# Altium project Amb_Enviro_MCU_PCB.PrjPcb
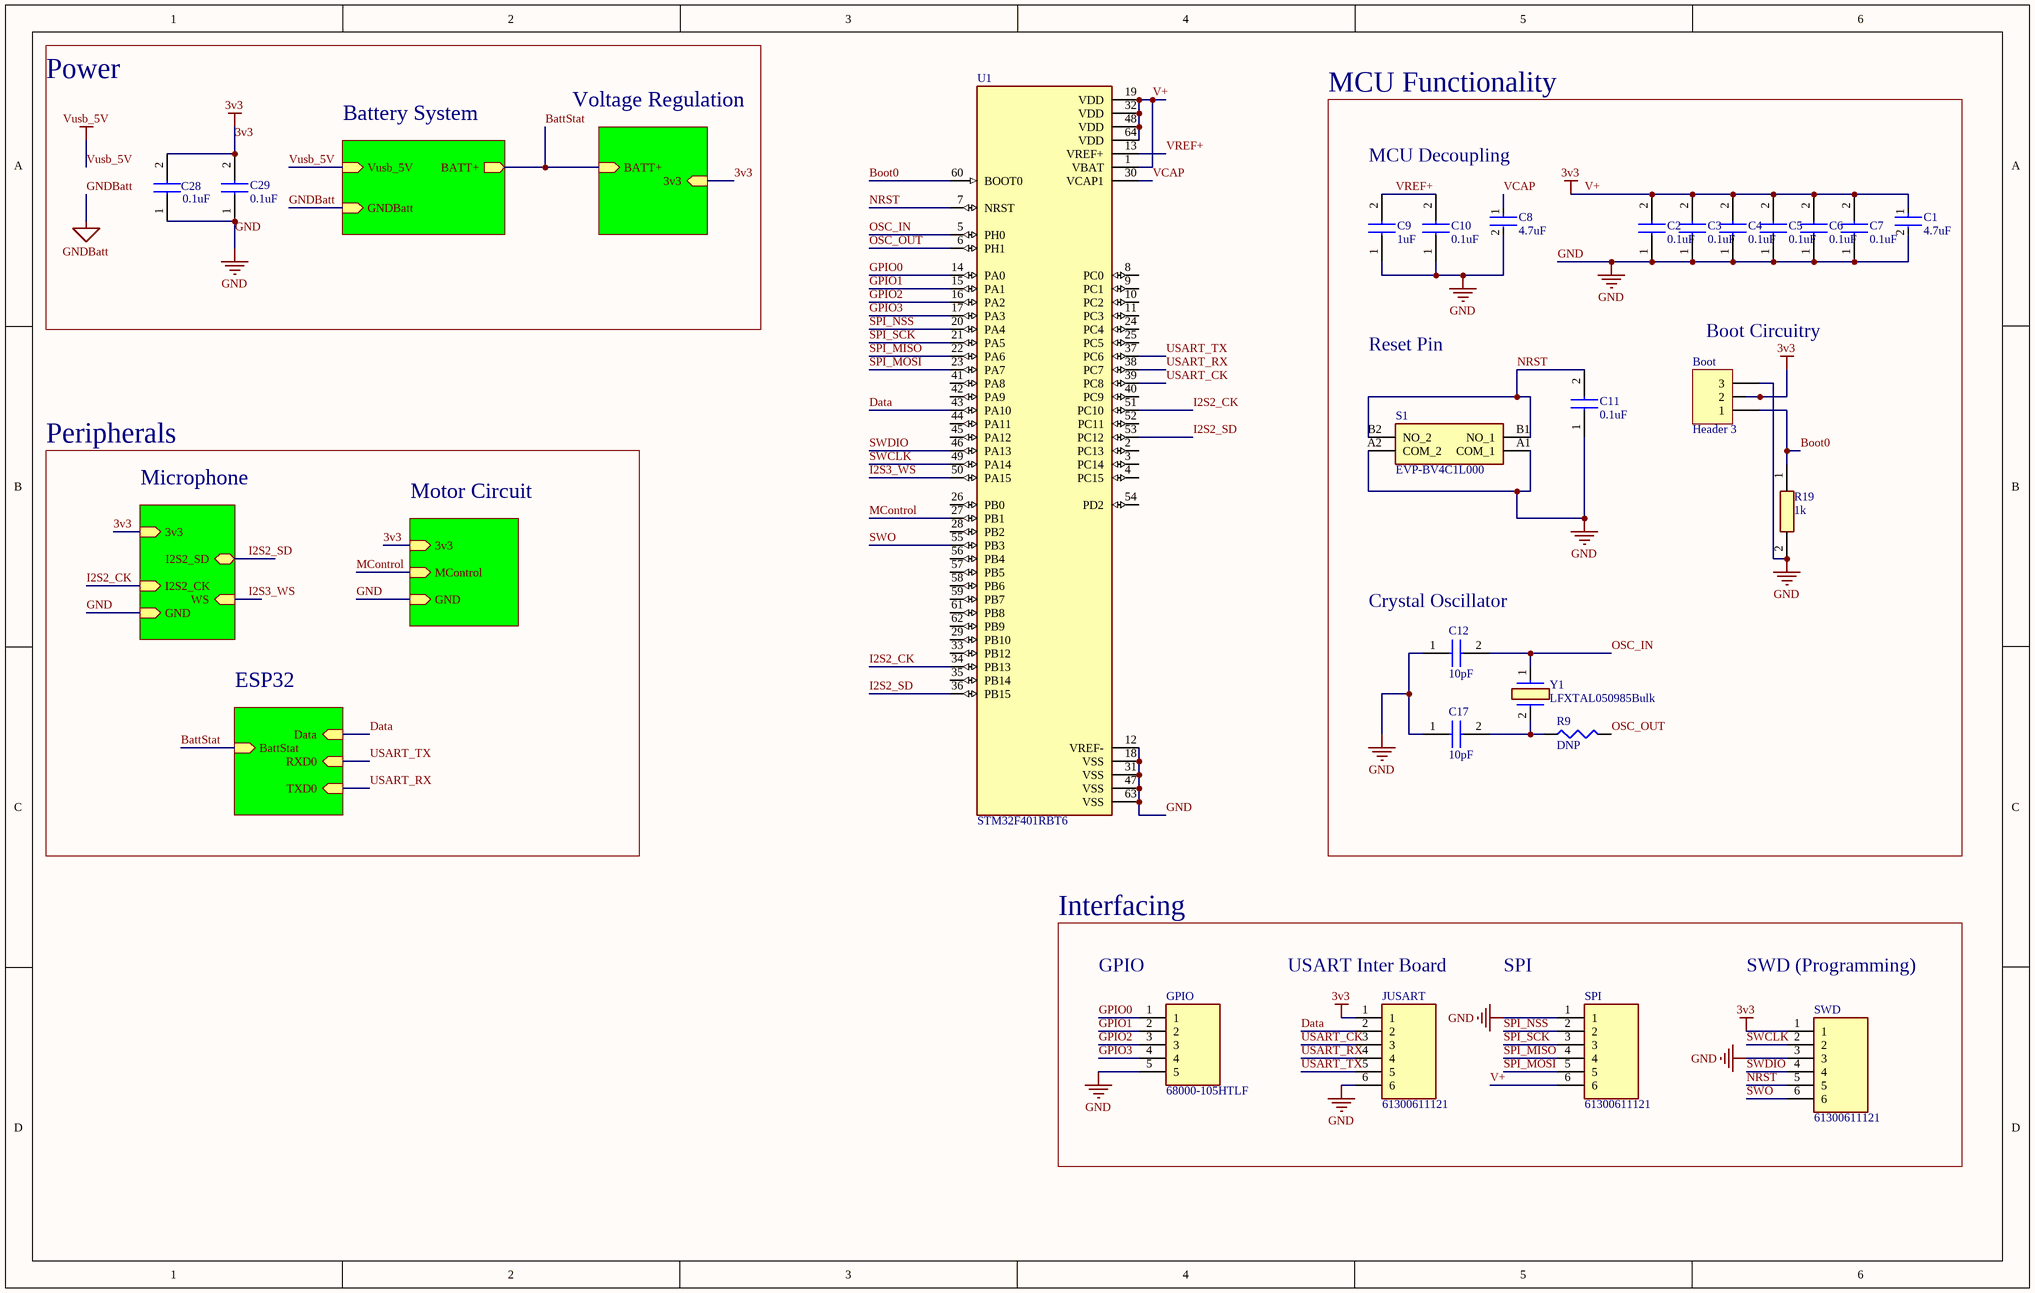
[diagram p0: MCU_Transceiver_Board.SchDoc]
6 sheets, 80 parts. Net scope: hierarchical (ports join the sheet entries above them; power ports are global).
Board file: MCU_Transceiver_Board.PcbDoc
Sheets:
  MCU_Transceiver_Board.SchDoc
    Microphone = Microphone.SchDoc
    Voltage Regulation = Voltage Regulation.SchDoc
    Battery System = Battery System.SchDoc
    Motor Circuit = Motor Circuit.SchDoc
    ESP32 = ESP32.SchDoc

## Sheet MCU_Transceiver_Board.SchDoc
size B; SheetNumber: 1; SheetTotal: 6

### Parts
Boot  Header 3  [HDR1X3]
C1  4.7uF  [FP-1206-L_3_2_0_2-W_1_6_0-IPC_B]
C2  0.1uF  [CAPC3216X180N]
C3  0.1uF  [CAPC3216X180N]
C4  0.1uF  [CAPC3216X180N]
C5  0.1uF  [CAPC3216X180N]
C6  0.1uF  [CAPC3216X180N]
C7  0.1uF  [CAPC3216X180N]
C8  4.7uF  [FP-1206-L_3_2_0_2-W_1_6_0-IPC_B]
C9  1uF  [CAPC1608X90N]
C10  0.1uF  [CAPC3216X180N]
C11  0.1uF  [CAPC3216X180N]
C12  10pF  [CAPC1608X90N]
C17  10pF  [CAPC1608X90N]
C28  0.1uF  [CAPC3216X180N]
C29  0.1uF  [CAPC3216X180N]
GPIO  68000-105HTLF  [HDRV5W67P0X254_1X5_1270X241X858P]
JUSART  61300611121  [HDRV6W64P0X254_1X6_1524X254X869P]
R9  value DNP  [J1-0603]  (hidden comment: Res3)
R19  1k  [RESC3016X65N]
S1  EVP-BV4C1L000  [EVPBV4C1L000]
SPI  61300611121  [HDRV6W64P0X254_1X6_1524X254X869P]
SWD  61300611121  [HDRV6W64P0X254_1X6_1524X254X869P]
U1  STM32F401RBT6  [QFP50P1200X1200X160-64N]
Y1  LFXTAL050985Bulk  [LFXTAL050985Bulk]

### Blocks framed on the sheet
Power: C28 C29
MCU Functionality: Boot C1-C12 C17 R9 R19 S1 Y1
Interfacing: GPIO JUSART SPI SWD

### Sub-sheets
Battery System = Battery System: Vusb_5V (in), GNDBatt (in), BATT+ (out)
ESP32 = ESP32: Data (in), RXD0 (in), TXD0 (in), BattStat (in)
Microphone = Microphone: 3v3 (in), I2S2_SD (bidir), I2S2_CK (in), GND (in), WS (in)
Motor Circuit = Motor Circuit: 3v3 (in), GND (in), MControl (in)
Voltage Regulation = Voltage Regulation: BATT+ (in), 3v3 (in)

### Nets
3v3: Boot.2 C1.1 C2.2 C3.2 C4.2 C5.2 C6.2 C7.2 C28.2 C29.2 JUSART.1 SPI.6 SWD.1 U1.1(VBAT) U1.19(VDD) U1.32(VDD) U1.48(VDD) U1.64(VDD) ; sheet Microphone/3v3, sheet Voltage Regulation/3v3, sheet Motor Circuit/3v3  [also labelled V+]
GND: Boot.3 C1.2 C2.1 C3.1 C4.1 C5.1 C6.1 C7.1 C8.2 C9.1 C10.1 C11.1 C12.1 C17.1 C28.1 C29.1 GPIO.5 JUSART.6 R19.2 S1.A1(COM_1) S1.A2(COM_2) SPI.1 SWD.3 U1.12(VREF-) U1.18(VSS) U1.31(VSS) U1.47(VSS) U1.63(VSS) ; sheet Microphone/GND, sheet Motor Circuit/GND
BattStat: sheet Voltage Regulation/BATT+, sheet Battery System/BATT+, sheet ESP32/BattStat
Boot0: Boot.1 R19.1 U1.60(BOOT0)
Data: JUSART.2 U1.43(PA10) ; sheet ESP32/Data
GPIO0: GPIO.1 U1.14(PA0)
GPIO1: GPIO.2 U1.15(PA1)
GPIO2: GPIO.3 U1.16(PA2)
GPIO3: GPIO.4 U1.17(PA3)
I2S2_CK: U1.34(PB13) U1.51(PC10) ; sheet Microphone/I2S2_CK
I2S2_SD: U1.36(PB15) U1.53(PC12) ; sheet Microphone/I2S2_SD
I2S3_WS: U1.50(PA15) ; sheet Microphone/WS
MControl: U1.27(PB1) ; sheet Motor Circuit/MControl
NRST: C11.2 S1.B1(NO_1) S1.B2(NO_2) SWD.5 U1.7(NRST)
OSC_IN: C12.2 U1.5(PH0) Y1.1
OSC_OUT: R9.2 U1.6(PH1)
SPI_MISO: SPI.4 U1.22(PA6)
SPI_MOSI: SPI.5 U1.23(PA7)
SPI_NSS: SPI.2 U1.20(PA4)
SPI_SCK: SPI.3 U1.21(PA5)
SWCLK: SWD.2 U1.49(PA14)
SWDIO: SWD.4 U1.46(PA13)
SWO: SWD.6 U1.55(PB3)
USART_CK: JUSART.3 U1.39(PC8)
USART_RX: JUSART.4 U1.38(PC7) ; sheet ESP32/TXD0  [project net TXD0]
USART_TX: JUSART.5 U1.37(PC6) ; sheet ESP32/RXD0  [project net RXD0]
VCAP: C8.1 U1.30(VCAP1)
VREF+: C9.2 C10.2 U1.13(VREF+)
NetC17_2: C17.2 R9.1 Y1.2

Not connected (* = marked no-connect by the designer): U1 2(PC13) 3(PC14) 4(PC15) 8(PC0) 9(PC1) 10(PC2) 11(PC3) 24(PC4) 25(PC5) 26(PB0) 28(PB2) 29(PB10) 33(PB12) 35(PB14) 40(PC9) 41(PA8) 42(PA9) 44(PA11) 45(PA12) 52(PC11) 54(PD2) 56(PB4) 57(PB5) 58(PB6) 59(PB7) 61(PB8) 62(PB9)

### Notes on the sheet
- MCU Decoupling
- Reset Pin
- (near Boot) Boot Circuitry
- Peripherals
- (near C12) Crystal Oscillator
- (near GPIO) GPIO
- (near JUSART) USART Inter Board
- SPI
- SWD (Programming)

### Library data of the parts
Boot = Header 3: Header, 3-Pin; LatestRevisionDate: 17-Jul-2002; LatestRevisionNote: Re-released for DXP Platform.; Publisher: Altium Limited
C1 C8 = CMP-04427-012562-1: General Purpose Ceramic Capacitor, 1206, 4.7uF, 20%, X5R, 15%, 16V, 1206YD475MAT2A; Dissipation Factor: 5%; Tolerance: 20%; Length: 3.2mm; Min Operating Temperature: -55°C; Width: 0.063inch; Capacitance: 4.7uF; Dielectric: X5R; Case Code (Imperial): 1206; Termination: SMD/SMT; Package Quantity: 1; Depth: 1.6mm; Height: 0.07mm; Voltage Rating: 16V; Mount: Surface Mount; Lead Free: Lead Free; Construction: Flat; Case/Package: 1206; Max Operating Temperature: 85°C; Contact Plating: Tin; Voltage Rating (DC): 16V; Series: -; Case Code (Metric): 3216; RoHS Compliant: Yes; Thickness: 0.07inch; Packaging: Tape and Reel; Number of Pins: 2; Radiation Hardening: No
C2 C10 C11 C28 C29 = GCM31C5C1H104FA16L: Capacitor, GCM31C5C1H104FA16L, 1206; Manufacturer_Name: Murata Electronics; Datasheet Link: https://www.digikey.in/product-detail/en/murata-electronics/GCM31C5C1H104FA16L/490-GCM31C5C1H104FA16LCT-ND/11618925; Height: 1.8mm; Manufacturer_Part_Number: GCM31C5C1H104FA16L; Mouser Part Number: 81-GCM31C5C1H104FA16; Mouser Price/Stock: https://www.mouser.co.uk/ProductDetail/Murata-Electronics/GCM31C5C1H104FA16L?qs=rrS6PyfT74fke0d0BEF0PA%3D%3D; Arrow Part Number: GCM31C5C1H104FA16L; Arrow Price/Stock: https://www.arrow.com/en/products/gcm31c5c1h104fa16l/murata-manufacturing
C3-C7 = GCM31C5C1H104FA16L: Capacitor, C5C1H104FA16L; Manufacturer_Name: Murata Electronics; Datasheet Link: https://www.digikey.in/product-detail/en/murata-electronics/GCM31C5C1H104FA16L/490-GCM31C5C1H104FA16LCT-ND/11618925; Height: 1.8mm; Manufacturer_Part_Number: GCM31C5C1H104FA16L; Mouser Part Number: 81-GCM31C5C1H104FA16; Mouser Price/Stock: https://www.mouser.co.uk/ProductDetail/Murata-Electronics/GCM31C5C1H104FA16L?qs=rrS6PyfT74fke0d0BEF0PA%3D%3D; Arrow Part Number: GCM31C5C1H104FA16L; Arrow Price/Stock: https://www.arrow.com/en/products/gcm31c5c1h104fa16l/murata-manufacturing
C9 = 0603YC105JAT2A: Capacitor, 0603YC10JAT2A; Manufacturer_Name: AVX; Datasheet Link: http://www.mouser.com/catalog/supplier/library/pdf/AVXSurfaceMountCeramic.pdf; Height: 0.9mm; Manufacturer_Part_Number: 0603YC105JAT2A; Mouser Part Number: 581-0603YC105JAT2A; Mouser Price/Stock: https://www.mouser.co.uk/ProductDetail/AVX/0603YC105JAT2A/?qs=RCLU9o6%252BptxSjO%252BNXwzoBQ%3D%3D; Arrow Part Number: 0603YC105JAT2A; Arrow Price/Stock: https://www.arrow.com/en/products/0603yc105jat2a/avx
C12 C17 = 06035A100F4T4A: Capacitor, 10pF, 06035A100F4T4A; Manufacturer_Name: AVX; Datasheet Link: https://componentsearchengine.com/Datasheets/1/06031A100FAT2A.pdf; Height: 0.9mm; Manufacturer_Part_Number: 06035A100F4T4A; Mouser Part Number: 581-06035A100F4T4A; Mouser Price/Stock: https://www.mouser.co.uk/ProductDetail/AVX/06035A100F4T4A?qs=T3oQrply3y8l7Nbuh1mZXA%3D%3D
GPIO = 68000-105HTLF: Connector; Manufacturer_Name: Amphenol; Datasheet Link: https://www.arrow.com/en/products/68000-105htlf/amphenol-fci; Height: 8.58mm; Manufacturer_Part_Number: 68000-105HTLF; Mouser Part Number: 649-68000-105HTLF; Mouser Price/Stock: https://www.mouser.co.uk/ProductDetail/Amphenol-FCI/68000-105HTLF?qs=w%2Fv1CP2dgqrYgNyQVoiqDw%3D%3D; Arrow Part Number: 68000-105HTLF; Arrow Price/Stock: https://www.arrow.com/en/products/68000-105htlf/amphenol-fci
JUSART SPI SWD = 61300611121: Connector; Manufacturer_Name: Wurth Elektronik; Datasheet Link: https://componentsearchengine.com/Datasheets/2/61300611121.pdf; Height: 8.69mm; Manufacturer_Part_Number: 61300611121; Mouser Part Number: 710-61300611121; Mouser Price/Stock: https://www.mouser.co.uk/ProductDetail/Wurth-Elektronik/61300611121?qs=t4813l51qx%2FRpdf0Kp1HlQ%3D%3D
R9 = Res3: Resistor; Published: 8-Jun-2000; LatestRevisionDate: 29-May-2009; LatestRevisionNote: IPC-7351 Footprint Added.; PackageReference: J1-0603; Publisher: Altium Limited; PackageDescription: Chip Resistor
R19 = CRT1206-FZ-1001ELF: Resistor, CRT1206-FZ-1001ELF; Manufacturer_Name: Bourns; Datasheet Link: http://www.bourns.com/docs/Product-Datasheets/crt-as.pdf; Height: 0.65mm; Manufacturer_Part_Number: CRT1206-FZ-1001ELF; Mouser Part Number: 652-CRT1206FZ1001ELF; Mouser Price/Stock: https://www.mouser.co.uk/ProductDetail/Bourns/CRT1206-FZ-1001ELF?qs=Zq5ylnUbLm4KSc2M9tALXQ%3D%3D; Arrow Part Number: CRT1206-FZ-1001ELF; Arrow Price/Stock: https://www.arrow.com/en/products/crt1206-fz-1001elf/bourns?region=nac
S1 = EVP-BV4C1L000: Switch; Manufacturer_Name: Panasonic; Datasheet Link: https://www.mouser.de/datasheet/2/315/Panasonic_Switch__EVP_BV_Series__030122-2933967.pdf; Height: 3.7mm; Manufacturer_Part_Number: EVP-BV4C1L000; Mouser Part Number: 667-EVP-BV4C1L000; Mouser Price/Stock: https://www.mouser.co.uk/ProductDetail/Panasonic/EVP-BV4C1L000?qs=MyNHzdoqoQKwTvV8HYjCOw%3D%3D
U1 = STM32F401RBT6: ARMÂ® CortexÂ®-M4 STM32F4 Microcontroller IC 32-Bit 84MHz 128KB _128K x 8_ FLASH 64-LQFP _10x10_; MF: STMicroelectronics; Availability: Unavailable; MP: STM32F401RBT6; Price: None; Value: *; SnapEDA_Link: https://www.snapeda.com/parts/STM32F401RBT6/STMicroelectronics/view-part/49021/?ref=snap; Package: LQFP-64 STMicroelectronics
Y1 = LFXTAL050985Bulk: Crystal or Oscillator; Manufacturer_Name: IQD; Datasheet Link: https://componentsearchengine.com/Datasheets/1/LFXTAL050985Bulk.pdf; Height: 4.3mm; Manufacturer_Part_Number: LFXTAL050985Bulk; Mouser Part Number: 449-LFXTAL050985BULK; Mouser Price/Stock: https://www.mouser.com/Search/Refine.aspx?Keyword=449-LFXTAL050985BULK

## Sheet Microphone.SchDoc
size A4; SheetNumber: 3; SheetTotal: 6
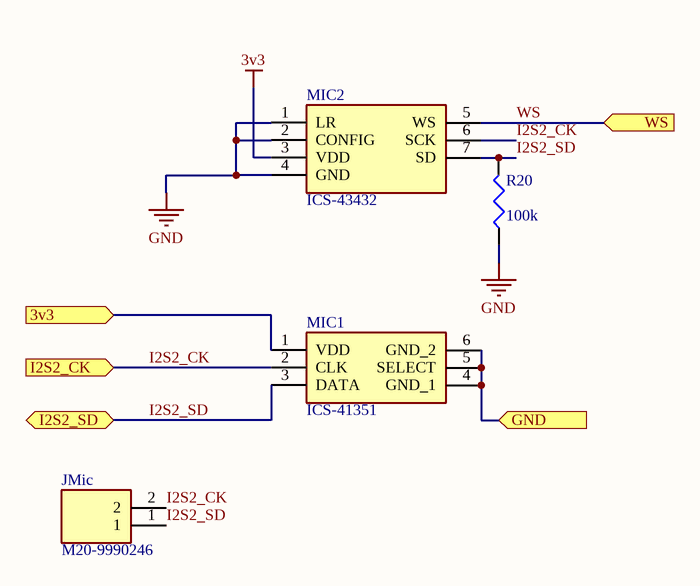
[diagram p1: Microphone.SchDoc]

### Parts
JMic  M20-9990246  [HDRV2W66P0X254_1X2_508X254X874P]
MIC1  ICS-41351  [ICS41351]
MIC2  ICS-43432  [ICS43432]
R20  value 100k  [J1-0603]  (hidden comment: Res3)

### Ports
3v3 (in), GND (in), I2S2_CK (in), I2S2_SD (bidir), WS (in)

### Nets
3v3: MIC1.1(VDD) MIC2.3(VDD) ; port 3v3
GND: MIC1.4(GND_1) MIC1.5(SELECT) MIC1.6(GND_2) MIC2.1(LR) MIC2.2(CONFIG) MIC2.4(GND) R20.1 ; port GND
I2S2_CK: JMic.2 MIC1.2(CLK) MIC2.6(SCK) ; port I2S2_CK
I2S2_SD: JMic.1 MIC1.3(DATA) MIC2.7(SD) R20.2 ; port I2S2_SD
WS: MIC2.5(WS) ; port WS  [project net I2S3_WS]

### Library data of the parts
JMic = M20-9990246: Connector; Manufacturer_Name: Harwin; Datasheet Link: https://cdn.harwin.com/pdfs/M20-999.pdf; Height: 8.74mm; Manufacturer_Part_Number: M20-9990246; Mouser Part Number: 855-M20-9990246; Mouser Price/Stock: https://www.mouser.co.uk/ProductDetail/Harwin/M20-9990246?qs=Jph8NoUxIfWjw4WmyRvzag%3D%3D
MIC1 = ICS-41351: Microphone; Manufacturer_Name: TDK; Datasheet Link: https://product.tdk.com/system/files/dam/doc/product/sw_piezo/mic/mems-mic/data_sheet/ds-000157-ics-41351-v1.1.pdf; Height: 1.08mm; Manufacturer_Part_Number: ICS-41351; Mouser Part Number: 410-ICS-41351; Mouser Price/Stock: https://www.mouser.co.uk/ProductDetail/TDK-InvenSense/ICS-41351?qs=%252B6g0mu59x7LDJ1mBnROZzA%3D%3D; Arrow Part Number: ICS-41351; Arrow Price/Stock: https://www.arrow.com/en/products/ics-41351/invensense
MIC2 = ICS-43432: Integrated Circuit; Manufacturer_Name: TDK; Datasheet Link: https://product.tdk.com/system/files/dam/doc/product/sw_piezo/mic/mems-mic/data_sheet/ics-43432-data-sheet-v1.3.pdf; Height: 1.1mm; Manufacturer_Part_Number: ICS-43432; Mouser Part Number: 410-ICS-43432; Mouser Price/Stock: https://www.mouser.co.uk/ProductDetail/TDK-InvenSense/ICS-43432?qs=u4fy%2FsgLU9PhEy4uYlgedw%3D%3D; Arrow Part Number: ICS-43432; Arrow Price/Stock: https://www.arrow.com/en/products/ics-43432/invensense?region=nac
R20 = Res3: Resistor; Published: 8-Jun-2000; LatestRevisionDate: 29-May-2009; LatestRevisionNote: IPC-7351 Footprint Added.; PackageReference: J1-0603; Publisher: Altium Limited; PackageDescription: Chip Resistor

## Sheet Voltage Regulation.SchDoc
size A4; SheetNumber: 5; SheetTotal: 6
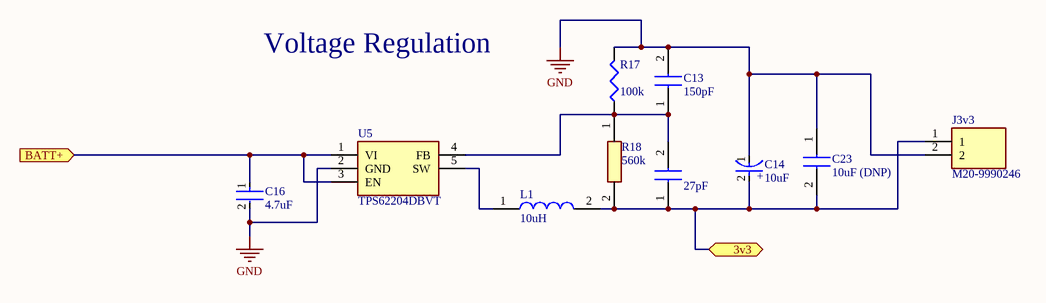
[diagram p2: Voltage Regulation.SchDoc]

### Parts
C13  150pF  [CAPC1608X90N]
C14  10uF  [FP-TAJS-MFG]
C16  4.7uF  [FP-1206-L_3_2_0_2-W_1_6_0-IPC_B]
C23  10uF (DNP)  [CAPC1608X90N]
J3v3  M20-9990246  [HDRV2W66P0X254_1X2_508X254X874P]
L1  10uH  [AISC1008F100GT]
R17  value 100k  [J1-0603]  (hidden comment: Res3)
R18  560k  [ERJS06_U06_(0805)]
U5  TPS62204DBVT  [SOT95P280X145-5N]
  27pF  [C0603]

### Ports
3v3 (bidir), BATT+ (in)

### Nets
3v3: C14.2(A) C23.2 J3v3.1 L1.2 R18.2 .1 ; port 3v3
GND: C13.2 C14.1(C) C16.2 C23.1 J3v3.2 R17.2 U5.2(GND)
BattStat: C16.1 U5.1(VI) U5.3(EN) ; port BATT+
NetC13_1: C13.1 R17.1 R18.1 U5.4(FB) .2
NetL1_1: L1.1 U5.5(SW)

### Notes on the sheet
- Voltage Regulation
- (in symbol CMP-04424-000459-1) +

### Library data of the parts
C13 = CL10C151JB8NNNC: Capacitor, CL10C151JB8NNNC, 150pF; Manufacturer_Name: Samsung Electro-Mechanics; Datasheet Link: https://datasheet.datasheetarchive.com/originals/dk/DKDS-19/373912.pdf; Height: 0.9mm; Manufacturer_Part_Number: CL10C151JB8NNNC; Mouser Part Number: 187-CL10C151JB8NNNC; Mouser Price/Stock: https://www.mouser.co.uk/ProductDetail/Samsung-Electro-Mechanics/CL10C151JB8NNNC?qs=349EhDEZ59rP%2F9hZgT8P9g%3D%3D; Arrow Part Number: CL10C151JB8NNNC; Arrow Price/Stock: https://www.arrow.com/en/products/cl10c151jb8nnnc/samsung-electro-mechanics
C14 = CMP-04424-000459-1: 10uF 2.5V  ±10% 8Ω 1206  SMD Tantalum Capacitor, TAJS106K002RNJ; Dissipation Factor: 6%; ESR (Equivalent Series Resistance): 8R; Lead Diameter: 1.2mm; Leakage Current: 500nA; Dielectric Material: Tantalum; Voltage Rating (DC): 2.5V; Weight: 0.000571oz; Tolerance: 10%; REACH SVHC: No SVHC; RoHS Compliant: Yes; Case Code (Metric): 3216; Min Operating Temperature: -55°C; Construction: Flat; Voltage Rating: 2.5V; Height: 1.2mm; Max Operating Temperature: 125°C; Case/Package: 1206; Packaging: Tape and Reel; Width: 1.6mm; Radiation Hardening: No; Mount: Surface Mount; Lead Free: Lead Free; Series: TAJ; Termination: SMD/SMT; Lead Pitch: 1.1mm; Depth: 1.6mm; Capacitance: 10uF; Length: 3.2mm; Number of Pins: 2; Voltage: 2.5V; Case Code (Imperial): 1206
C16 = CMP-04427-012562-1: as C1 on sheet MCU_Transceiver_Board; Tolerance: 20%; Length: 3.2mm; Min Operating Temperature: -55°C; Width: 0.063inch; Capacitance: 4.7uF; Dielectric: X5R; Case Code (Imperial): 1206; Termination: SMD/SMT; Package Quantity: 1; Depth: 1.6mm; Height: 0.07mm; Voltage Rating: 16V; Mount: Surface Mount; Lead Free: Lead Free; Construction: Flat; Case/Package: 1206; Max Operating Temperature: 85°C; Contact Plating: Tin; Voltage Rating (DC): 16V; Series: -; Case Code (Metric): 3216; RoHS Compliant: Yes; Thickness: 0.07inch; Packaging: Tape and Reel; Number of Pins: 2; Radiation Hardening: No
C23 = CL10A106MQ8NNNC: Capacitor, CL10A106MQ8NNNC; Manufacturer_Name: Samsung Electro-Mechanics; Datasheet Link: http://uk.rs-online.com/web/p/products/7664718; Height: 0.9mm; Manufacturer_Part_Number: CL10A106MQ8NNNC; Mouser Part Number: 187-CL10A106MQ8NNNC; Mouser Price/Stock: https://www.mouser.co.uk/ProductDetail/Samsung-Electro-Mechanics/CL10A106MQ8NNNC?qs=349EhDEZ59qlB6a%2FjjeGAg%3D%3D; Arrow Part Number: CL10A106MQ8NNNC; Arrow Price/Stock: https://www.arrow.com/en/products/cl10a106mq8nnnc/samsung-electro-mechanics?region=nac
J3v3 = M20-9990246: Connector; Manufacturer_Name: Harwin; Datasheet Link: https://cdn.harwin.com/pdfs/M20-999.pdf; Height: 8.74mm; Manufacturer_Part_Number: M20-9990246; Mouser Part Number: 855-M20-9990246; Mouser Price/Stock: https://www.mouser.co.uk/ProductDetail/Harwin/M20-9990246?qs=Jph8NoUxIfWjw4WmyRvzag%3D%3D
L1 = AISC-1008F-100G-T: Inductor, AISC-1008F-100G-T; Manufacturer_Name: ABRACON; Datasheet Link: https://www.mouser.com/datasheet/2/3/AISC-1008(F)-27775.pdf; Height: 2.29mm; Manufacturer_Part_Number: AISC-1008F-100G-T; Mouser Part Number: 815-AISC1008F100GT; Mouser Price/Stock: https://www.mouser.com/Search/Refine.aspx?Keyword=815-AISC1008F100GT; Arrow Part Number: AISC-1008F-100G-T; Arrow Price/Stock: https://www.arrow.com/en/products/aisc-1008f-100g-t/abracon
R17 = Res3: Resistor; Published: 8-Jun-2000; LatestRevisionDate: 29-May-2009; LatestRevisionNote: IPC-7351 Footprint Added.; PackageReference: J1-0603; Publisher: Altium Limited; PackageDescription: Chip Resistor
R18 = ERJ-U06F5603V: Resistor, ERJ-U06F5603V, 560k; Manufacturer_Name: Panasonic; Datasheet Link: https://industrial.panasonic.com/cdbs/www-data/pdf/RDP0000/AOA0000C334.pdf; Height: 0.7mm; Manufacturer_Part_Number: ERJ-U06F5603V; Mouser Part Number: 667-ERJ-U06F5603V; Mouser Price/Stock: http://www.mouser.com/Search/ProductDetail.aspx?qs=Yyy8avaXlIvDfDSBlVZXaA%3d%3d
U5 = TPS62204DBVT: Integrated Circuit; Manufacturer_Name: Texas Instruments; Datasheet Link: http://www.ti.com/lit/gpn/tps62204; Height: 1.45mm; Manufacturer_Part_Number: TPS62204DBVT; Mouser Part Number: 595-TPS62204DBVT; Mouser Price/Stock: https://www.mouser.com/Search/Refine.aspx?Keyword=595-TPS62204DBVT; Arrow Part Number: TPS62204DBVT; Arrow Price/Stock: https://www.arrow.com/en/products/tps62204dbvt/texas-instruments
 = C0603C270J5GAC7411: Capacitor, C0603C270J5GAC7411, 27pF; Manufacturer_Name: KEMET; Datasheet Link: https://content.kemet.com/datasheets/KEM_C1003_C0G_SMD.pdf; Height: 0.87mm; Manufacturer_Part_Number: C0603C270J5GAC7411

## Sheet Battery System.SchDoc
size A4; SheetNumber: 2; SheetTotal: 6
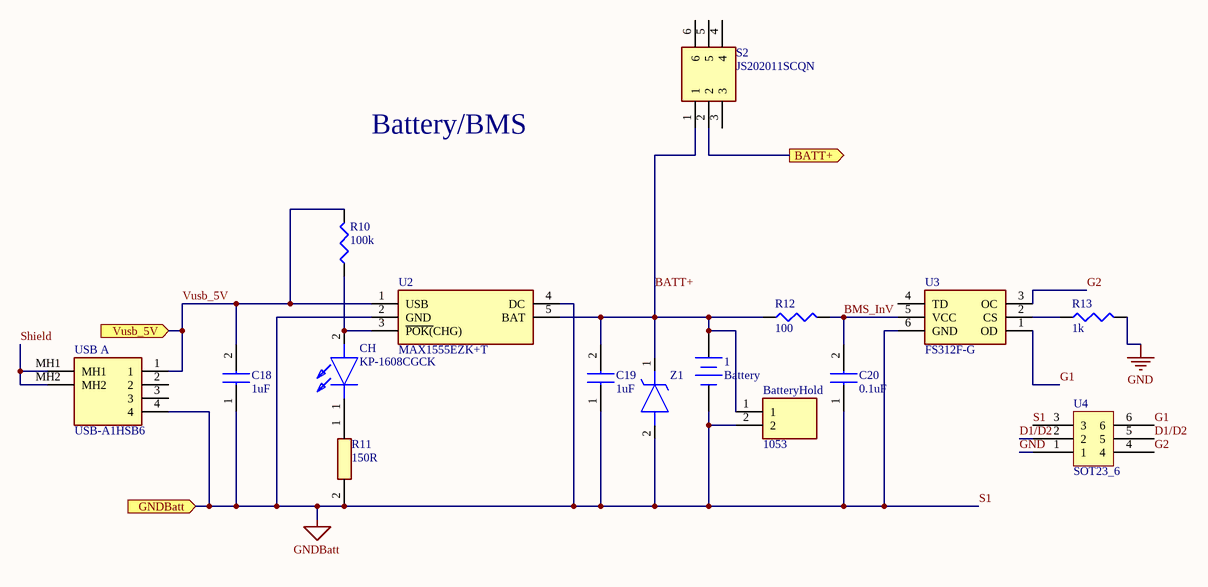
[diagram p3: Battery System.SchDoc]

### Parts
1  Battery  [BAT-2]
BatteryHold  1053  [1053]
C18  1uF  [CAPC1608X90N]
C19  1uF  [CAPC1608X90N]
C20  0.1uF  [CAPC3216X180N]
CH  KP-1608CGCK  [LEDC1608X120N]
R10  value 100k  [J1-0603]  (hidden comment: Res3)
R11  150R  [RESC1608X55N]
R12  value 100  [J1-0603]  (hidden comment: Res3)
R13  value 1k  [J1-0603]  (hidden comment: Res3)
S2  JS202011SCQN  [JS202011SCQN]
U2  MAX1555EZK+T  [SOT95P275X110-5N]
U3  FS312F-G  [SOT95P280X145-6N]
U4  SOT23_6  [SOT95P275X110-6N]
USB_A  USB-A1HSB6  [USBA1HSB6]
Z1  PTZTFTE253.3B  [DIOM5026X220N]  (value not drawn)

### Ports
BATT+ (out), GNDBatt (in), Vusb_5V (in)

### Nets
GND: R13.2 U4.1
GNDBatt: 1.2(-) BatteryHold.2 C18.1 C19.1 C20.1 R11.2 U2.2(GND) U2.4(DC) U3.6(GND) U4.3 USB_A.4 Z1.2(A) ; port GNDBatt  [also labelled S1]
Vusb_5V: C18.2 R10.2 U2.1(USB) USB_A.1 ; port Vusb_5V
BATT+: 1.1(+) BatteryHold.1 C19.2 R12.1 S2.1 U2.5(BAT) Z1.1(K)
BattStat: S2.2 ; port BATT+
BMS_InV: C20.2 R12.2 U3.5(VCC)
D1/D2: U4.2 U4.5
G1: U3.1(OD) U4.6
G2: U3.3(OC) U4.4
Shield: USB_A.MH1 USB_A.MH2
NetCH_1: CH.1(K) R11.1
NetCH_2: CH.2(A) R10.1 U2.3(~{POK(}CHG))
NetR13_1: R13.1 U3.2(CS)

Not connected (* = marked no-connect by the designer): S2 3 4 5 6; U3 4(TD); USB_A 2 3

### Notes on the sheet
- Battery/BMS

### Library data of the parts
1 = Battery: Multicell Battery; Published: 24-Mar-1999; LatestRevisionDate: 17-Jul-2002; LatestRevisionNote: Re-released for DXP Platform.; PackageReference: BAT-2; Publisher: Altium Limited; PackageDescription: Battery; 2 Leads
BatteryHold = 1053: Undefined or Miscellaneous; Manufacturer_Name: Keystone Electronics; Datasheet Link: http://www.keyelco.com/product-pdf.cfm?p=751; Manufacturer_Part_Number: 1053; Mouser Part Number: 534-1053-BH; Mouser Price/Stock: https://www.mouser.co.uk/ProductDetail/Keystone-Electronics/1053?qs=%2F7TOpeL5Mz4zfgvqwo9sng%3D%3D; Arrow Part Number: 1053; Arrow Price/Stock: https://www.arrow.com/en/products/1053/keystone-electronics
C18 C19 = 0603YC105JAT2A: as C9 on sheet MCU_Transceiver_Board; Datasheet Link: http://www.mouser.com/catalog/supplier/library/pdf/AVXSurfaceMountCeramic.pdf; Height: 0.9mm; Manufacturer_Part_Number: 0603YC105JAT2A; Mouser Part Number: 581-0603YC105JAT2A; Mouser Price/Stock: https://www.mouser.co.uk/ProductDetail/AVX/0603YC105JAT2A/?qs=RCLU9o6%252BptxSjO%252BNXwzoBQ%3D%3D; Arrow Part Number: 0603YC105JAT2A; Arrow Price/Stock: https://www.arrow.com/en/products/0603yc105jat2a/avx
C20 = GCM31C5C1H104FA16L: as C2 on sheet MCU_Transceiver_Board; Datasheet Link: https://www.digikey.in/product-detail/en/murata-electronics/GCM31C5C1H104FA16L/490-GCM31C5C1H104FA16LCT-ND/11618925; Height: 1.8mm; Manufacturer_Part_Number: GCM31C5C1H104FA16L; Mouser Part Number: 81-GCM31C5C1H104FA16; Mouser Price/Stock: https://www.mouser.co.uk/ProductDetail/Murata-Electronics/GCM31C5C1H104FA16L?qs=rrS6PyfT74fke0d0BEF0PA%3D%3D; Arrow Part Number: GCM31C5C1H104FA16L; Arrow Price/Stock: https://www.arrow.com/en/products/gcm31c5c1h104fa16l/murata-manufacturing
CH = KP-1608CGCK: LED; Manufacturer_Name: Kingbright; Datasheet Link: https://componentsearchengine.com/Datasheets/2/KP-1608CGCK.pdf; Height: 1.2mm; Manufacturer_Part_Number: KP-1608CGCK; Mouser Part Number: N/A; Mouser Price/Stock: https://www.mouser.co.uk/ProductDetail/Kingbright/KP-1608CGCK?qs=2JU0tDl2GZ3U0MYrqLedOQ%3D%3D; Arrow Part Number: KP-1608CGCK; Arrow Price/Stock: https://www.arrow.com/en/products/kp-1608cgck/kingbright?region=europe
R10 R12 R13 = Res3: Resistor; Published: 8-Jun-2000; LatestRevisionDate: 29-May-2009; LatestRevisionNote: IPC-7351 Footprint Added.; PackageReference: J1-0603; Publisher: Altium Limited; PackageDescription: Chip Resistor
R11 = CR0603-FX-1500ELF: Resistor, CR0603-FX-1500ELF; Manufacturer_Name: Bourns; Datasheet Link: https://www.bourns.com/pdfs/chpreztr.pdf; Height: 0.55mm; Manufacturer_Part_Number: CR0603-FX-1500ELF; Mouser Part Number: 652-CR0603FX-1500ELF; Mouser Price/Stock: https://www.mouser.co.uk/ProductDetail/Bourns/CR0603-FX-1500ELF?qs=e7cxVwPieupBDLrUX3Cc4g%3D%3D; Arrow Part Number: CR0603-FX-1500ELF; Arrow Price/Stock: https://www.arrow.com/en/products/cr0603-fx-1500elf/bourns?region=nac
S2 = JS202011SCQN: Switch; Manufacturer_Name: C & K COMPONENTS; Datasheet Link: http://www.ckswitches.com/media/1422/js.pdf; Height: 5.5mm; Manufacturer_Part_Number: JS202011SCQN; Mouser Part Number: 611-JS202011SCQN; Mouser Price/Stock: https://www.mouser.co.uk/ProductDetail/CK/JS202011SCQN?qs=LgMIjt8LuD95JYWxZ7NvZA%3D%3D; Arrow Part Number: JS202011SCQN; Arrow Price/Stock: https://www.arrow.com/en/products/js202011scqn/ck?region=nac
U2 = MAX1555EZK+T: Integrated Circuit; Manufacturer_Name: Maxim Integrated; Datasheet Link: http://datasheets.maximintegrated.com/en/ds/MAX1551-MAX1555.pdf; Height: 1.1mm; Manufacturer_Part_Number: MAX1555EZK+T; Mouser Part Number: 700-MAX1555EZK+T; Mouser Price/Stock: https://www.mouser.co.uk/ProductDetail/Maxim-Integrated/MAX1555EZK%2bT?qs=LHmEVA8xxfYLEoVKeceKJA%3D%3D; Arrow Part Number: MAX1555EZK+T; Arrow Price/Stock: https://www.arrow.com/en/products/max1555ezkt/maxim-integrated?region=nac
U3 = FS312F-G: Integrated Circuit; Manufacturer_Name: Fortune Semiconductor Corporation; Datasheet Link: https://www.ic-fortune.com/upload/Download/FS312F-G-DS-12_EN.pdf; Height: 1.45mm; Manufacturer_Part_Number: FS312F-G
USB_A = USB-A1HSB6: Connector; Manufacturer_Name: On Shore Technology Inc.; Datasheet Link: http://www.on-shore.com/wp-content/uploads/2015/09/usb-a1hsxx.pdf; Height: 7.1mm; Manufacturer_Part_Number: USB-A1HSB6
Z1 = PTZTFTE253.3B: Zener Diode; Manufacturer_Name: ROHM Semiconductor; Datasheet Link: https://fscdn.rohm.com/en/products/databook/datasheet/discrete/diode/zener/ptztfte252.2b-e.pdf; Height: 2.2mm; Manufacturer_Part_Number: PTZTFTE253.3B; Mouser Part Number: 755-PTZTFTE253.3B; Mouser Price/Stock: https://www.mouser.co.uk/ProductDetail/ROHM-Semiconductor/PTZTFTE253.3B?qs=4v%252BiZTmLVHEC5iicBmVMIQ%3D%3D

## Sheet Motor Circuit.SchDoc
size A4; SheetNumber: 4; SheetTotal: 6
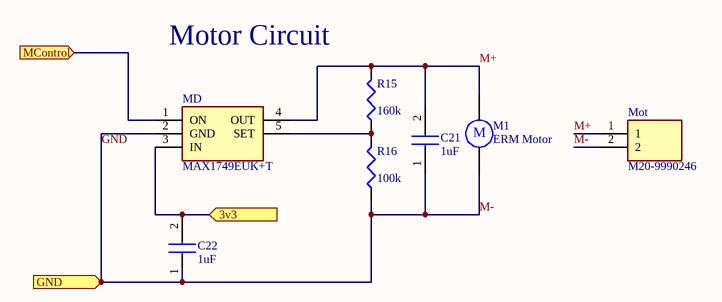
[diagram p4: Motor Circuit.SchDoc]

### Parts
C21  1uF  [CAPC1608X90N]
C22  1uF  [CAPC1608X90N]
M1  ERM Motor  [RB5-10.5]
MD  MAX1749EUK+T  [SOT95P280X145-5N]
Mot  M20-9990246  [HDRV2W66P0X254_1X2_508X254X874P]
R15  value 160k  [J1-0603]  (hidden comment: Res3)
R16  value 100k  [J1-0603]  (hidden comment: Res3)

### Ports
3v3 (in), GND (in), MControl (in)

### Nets
3v3: C22.2 MD.3(IN) ; port 3v3
GND: C21.1 C22.1 M1.2 MD.2(GND) Mot.2 R16.1 ; port GND  [also labelled M-]
M+: C21.2 M1.1 MD.4(OUT) Mot.1 R15.2
MControl: MD.1(ON) ; port MControl
NetMD_5: MD.5(SET) R15.1 R16.2

### Notes on the sheet
- (near R15) Motor Circuit
- (in symbol Motor) M

### Library data of the parts
C21 C22 = 0603YC105JAT2A: as C9 on sheet MCU_Transceiver_Board; Datasheet Link: http://www.mouser.com/catalog/supplier/library/pdf/AVXSurfaceMountCeramic.pdf; Height: 0.9mm; Manufacturer_Part_Number: 0603YC105JAT2A; Mouser Part Number: 581-0603YC105JAT2A; Mouser Price/Stock: https://www.mouser.co.uk/ProductDetail/AVX/0603YC105JAT2A/?qs=RCLU9o6%252BptxSjO%252BNXwzoBQ%3D%3D; Arrow Part Number: 0603YC105JAT2A; Arrow Price/Stock: https://www.arrow.com/en/products/0603yc105jat2a/avx
M1 = Motor: VC1234B016F; Published: 24-Mar-1999; LatestRevisionDate: 17-Jul-2002; LatestRevisionNote: Re-released for DXP Platform.; PackageReference: RB5-10.5; Publisher: Altium Limited; PackageDescription: Capacitor (Radial); 2 Leads
MD = MAX1749EUK+T: Integrated Circuit; Manufacturer_Name: Maxim Integrated; Datasheet Link: https://pdfserv.maximintegrated.com/en/ds/MAX1749.pdf; Height: 1.45mm; Manufacturer_Part_Number: MAX1749EUK+T
Mot = M20-9990246: Connector; Manufacturer_Name: Harwin; Datasheet Link: https://cdn.harwin.com/pdfs/M20-999.pdf; Height: 8.74mm; Manufacturer_Part_Number: M20-9990246; Mouser Part Number: 855-M20-9990246; Mouser Price/Stock: https://www.mouser.co.uk/ProductDetail/Harwin/M20-9990246?qs=Jph8NoUxIfWjw4WmyRvzag%3D%3D
R15 R16 = Res3: Resistor; Published: 8-Jun-2000; LatestRevisionDate: 29-May-2009; LatestRevisionNote: IPC-7351 Footprint Added.; PackageReference: J1-0603; Publisher: Altium Limited; PackageDescription: Chip Resistor

## Sheet ESP32.SchDoc
size A4; SheetNumber: 6; SheetTotal: 6
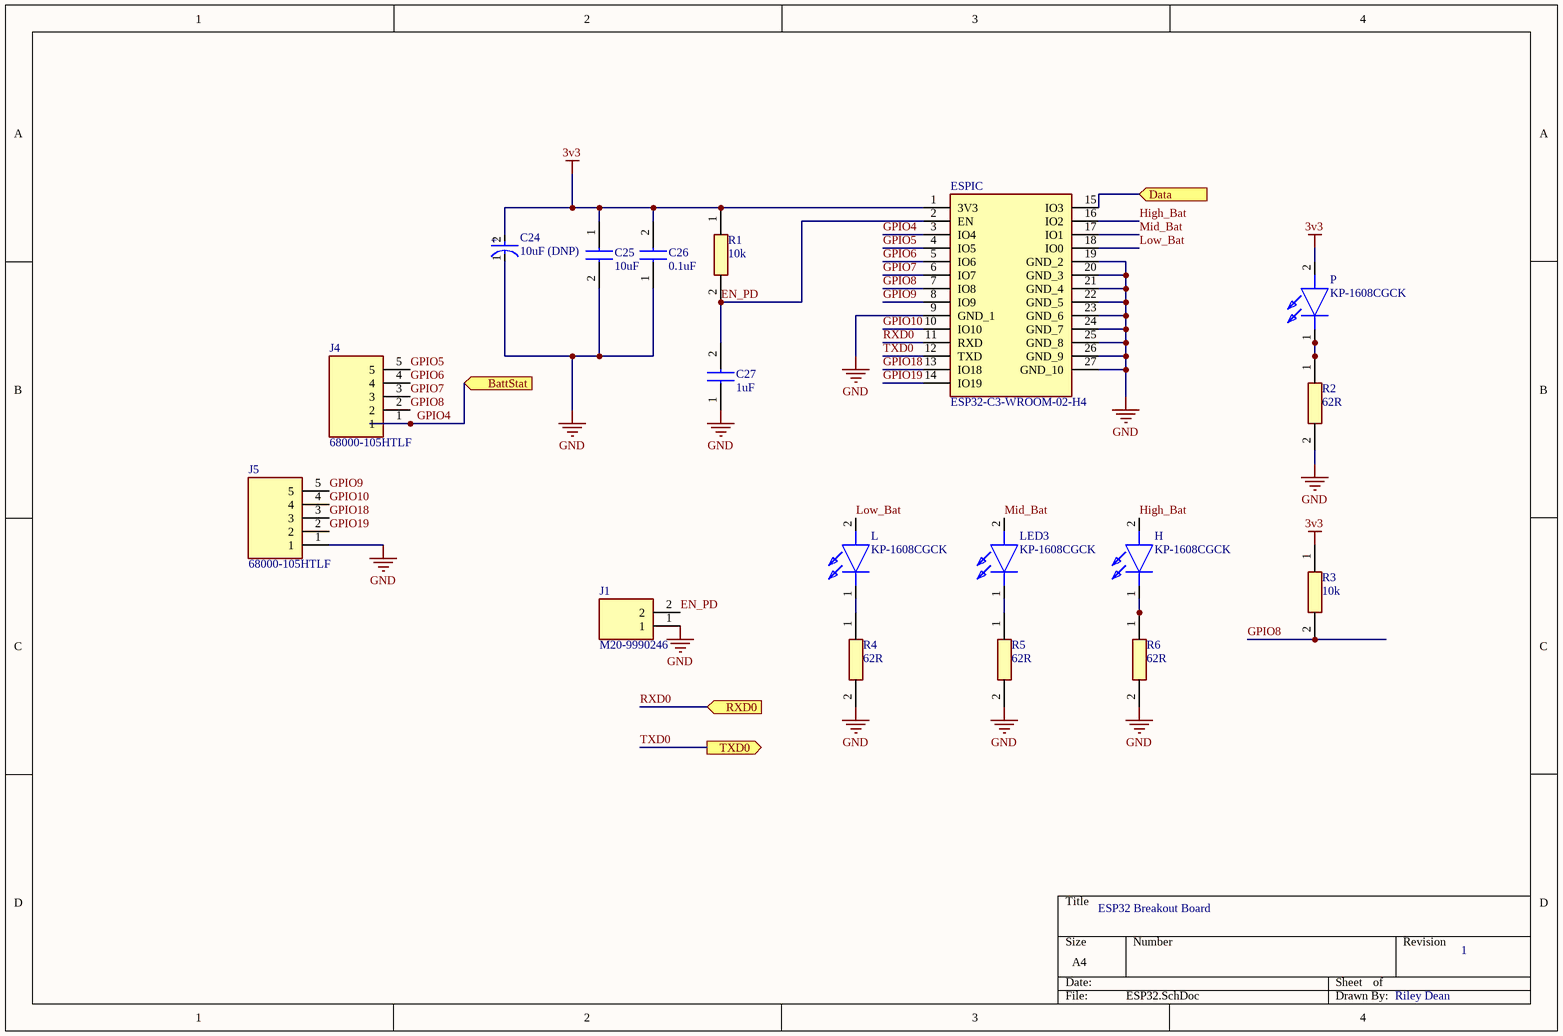
[diagram p5: ESP32.SchDoc]

### Parts
C24  10uF (DNP)  [FP-TAJS-MFG]
C25  10uF  [CAPC1608X90N]
C26  0.1uF  [CAPC3216X180N]
C27  1uF  [CAPC1608X90N]
ESPIC  ESP32-C3-WROOM-02-H4  [ESP32C3WROOM02H4]
H  KP-1608CGCK  [LEDC1608X120N]
J1  M20-9990246  [HDRV2W66P0X254_1X2_508X254X874P]
J4  68000-105HTLF  [HDRV5W67P0X254_1X5_1270X241X858P]
J5  68000-105HTLF  [HDRV5W67P0X254_1X5_1270X241X858P]
L  KP-1608CGCK  [LEDC1608X120N]
LED3  KP-1608CGCK  [LEDC1608X120N]
P  KP-1608CGCK  [LEDC1608X120N]
R1  10k  [RESC2012X60N]
R2  62R  [ERJH3]
R3  10k  [RESC2012X60N]
R4  62R  [ERJH3]
R5  62R  [ERJH3]
R6  62R  [ERJH3]

### Ports
BattStat (in), Data (in), RXD0 (in), TXD0 (out)

### Nets
3v3: C24.2(A) C25.1 C26.2 ESPIC.1(3V3) P.2(A) R1.1 R3.1
GND: C24.1(C) C25.2 C26.1 C27.1 ESPIC.9(GND_1) ESPIC.19(GND_2) ESPIC.20(GND_3) ESPIC.21(GND_4) ESPIC.22(GND_5) ESPIC.23(GND_6) ESPIC.24(GND_7) ESPIC.25(GND_8) ESPIC.26(GND_9) ESPIC.27(GND_10) J1.1 J5.1 R2.2 R4.2 R5.2 R6.2
Data: ESPIC.15(IO3) ; port Data
EN_PD: C27.2 ESPIC.2(EN) J1.2 R1.2
GPIO4: ESPIC.3(IO4) J4.1 ; port BattStat  [project net BattStat]
GPIO5: ESPIC.4(IO5) J4.5
GPIO6: ESPIC.5(IO6) J4.4
GPIO7: ESPIC.6(IO7) J4.3
GPIO8: ESPIC.7(IO8) J4.2 R3.2
GPIO9: ESPIC.8(IO9) J5.5
GPIO10: ESPIC.10(IO10) J5.4
GPIO18: ESPIC.13(IO18) J5.3
GPIO19: ESPIC.14(IO19) J5.2
High_Bat: ESPIC.16(IO2) H.2(A)
Low_Bat: ESPIC.18(IO0) L.2(A)
Mid_Bat: ESPIC.17(IO1) LED3.2(A)
RXD0: ESPIC.11(RXD) ; port RXD0
TXD0: ESPIC.12(TXD) ; port TXD0
NetH_1: H.1(K) R6.1
NetL_1: L.1(K) R4.1
NetLED3_1: LED3.1(K) R5.1
NetP_1: P.1(K) R2.1

### Notes on the sheet
- ESP32 Breakout Board
- 1
- Riley Dean
- (in symbol CMP-04424-000459-1) +

### Library data of the parts
C24 = CMP-04424-000459-1: as C14 on sheet Voltage Regulation; Dielectric Material: Tantalum; Voltage Rating (DC): 2.5V; Weight: 0.000571oz; Tolerance: 10%; REACH SVHC: No SVHC; RoHS Compliant: Yes; Case Code (Metric): 3216; Min Operating Temperature: -55°C; Construction: Flat; Voltage Rating: 2.5V; Height: 1.2mm; Max Operating Temperature: 125°C; Case/Package: 1206; Packaging: Tape and Reel; Width: 1.6mm; Radiation Hardening: No; Mount: Surface Mount; Lead Free: Lead Free; Series: TAJ; Termination: SMD/SMT; Lead Pitch: 1.1mm; Depth: 1.6mm; Capacitance: 10uF; Length: 3.2mm; Number of Pins: 2; Voltage: 2.5V; Case Code (Imperial): 1206
C25 = CL10A106MQ8NNNC: as C23 on sheet Voltage Regulation; Datasheet Link: http://uk.rs-online.com/web/p/products/7664718; Height: 0.9mm; Manufacturer_Part_Number: CL10A106MQ8NNNC; Mouser Part Number: 187-CL10A106MQ8NNNC; Mouser Price/Stock: https://www.mouser.co.uk/ProductDetail/Samsung-Electro-Mechanics/CL10A106MQ8NNNC?qs=349EhDEZ59qlB6a%2FjjeGAg%3D%3D; Arrow Part Number: CL10A106MQ8NNNC; Arrow Price/Stock: https://www.arrow.com/en/products/cl10a106mq8nnnc/samsung-electro-mechanics?region=nac
C26 = GCM31C5C1H104FA16L: as C2 on sheet MCU_Transceiver_Board; Datasheet Link: https://www.digikey.in/product-detail/en/murata-electronics/GCM31C5C1H104FA16L/490-GCM31C5C1H104FA16LCT-ND/11618925; Height: 1.8mm; Manufacturer_Part_Number: GCM31C5C1H104FA16L; Mouser Part Number: 81-GCM31C5C1H104FA16; Mouser Price/Stock: https://www.mouser.co.uk/ProductDetail/Murata-Electronics/GCM31C5C1H104FA16L?qs=rrS6PyfT74fke0d0BEF0PA%3D%3D; Arrow Part Number: GCM31C5C1H104FA16L; Arrow Price/Stock: https://www.arrow.com/en/products/gcm31c5c1h104fa16l/murata-manufacturing
C27 = 0603YC105JAT2A: as C9 on sheet MCU_Transceiver_Board; Datasheet Link: http://www.mouser.com/catalog/supplier/library/pdf/AVXSurfaceMountCeramic.pdf; Height: 0.9mm; Manufacturer_Part_Number: 0603YC105JAT2A; Mouser Part Number: 581-0603YC105JAT2A; Mouser Price/Stock: https://www.mouser.co.uk/ProductDetail/AVX/0603YC105JAT2A/?qs=RCLU9o6%252BptxSjO%252BNXwzoBQ%3D%3D; Arrow Part Number: 0603YC105JAT2A; Arrow Price/Stock: https://www.arrow.com/en/products/0603yc105jat2a/avx
ESPIC = ESP32-C3-WROOM-02-H4: Integrated Circuit; Manufacturer_Name: Espressif Systems; Datasheet Link: https://www.mouser.in/datasheet/2/891/Espressif_Systems_04082021_ESP32_C3_WROOM_02-2295851.pdf; Height: 3.35mm; Manufacturer_Part_Number: ESP32-C3-WROOM-02-H4; Mouser Part Number: 356-ESP32C3WROOM02H4; Mouser Price/Stock: https://www.mouser.co.uk/ProductDetail/Espressif-Systems/ESP32-C3-WROOM-02-H4?qs=stqOd1AaK79%2FSA14oWtR%252Bw%3D%3D
H L LED3 P = KP-1608CGCK: LED; Manufacturer_Name: Kingbright; Datasheet Link: https://componentsearchengine.com/Datasheets/2/KP-1608CGCK.pdf; Height: 1.2mm; Manufacturer_Part_Number: KP-1608CGCK; Mouser Part Number: N/A; Mouser Price/Stock: https://www.mouser.co.uk/ProductDetail/Kingbright/KP-1608CGCK?qs=2JU0tDl2GZ3U0MYrqLedOQ%3D%3D; Arrow Part Number: KP-1608CGCK; Arrow Price/Stock: https://www.arrow.com/en/products/kp-1608cgck/kingbright?region=europe
J1 = M20-9990246: Connector; Manufacturer_Name: Harwin; Datasheet Link: https://cdn.harwin.com/pdfs/M20-999.pdf; Height: 8.74mm; Manufacturer_Part_Number: M20-9990246; Mouser Part Number: 855-M20-9990246; Mouser Price/Stock: https://www.mouser.co.uk/ProductDetail/Harwin/M20-9990246?qs=Jph8NoUxIfWjw4WmyRvzag%3D%3D
J4 J5 = 68000-105HTLF: Connector; Manufacturer_Name: Amphenol; Datasheet Link: https://www.arrow.com/en/products/68000-105htlf/amphenol-fci; Height: 8.58mm; Manufacturer_Part_Number: 68000-105HTLF; Mouser Part Number: 649-68000-105HTLF; Mouser Price/Stock: https://www.mouser.co.uk/ProductDetail/Amphenol-FCI/68000-105HTLF?qs=w%2Fv1CP2dgqrYgNyQVoiqDw%3D%3D; Arrow Part Number: 68000-105HTLF; Arrow Price/Stock: https://www.arrow.com/en/products/68000-105htlf/amphenol-fci
R1 R3 = RC0805FR-7W10KL: Resistor, RC0805FR-7W10KL, 10k; Manufacturer_Name: KEMET; Datasheet Link: https://datasheet.datasheetarchive.com/originals/distributors/Datasheets_SAMA/902f9e387b938f871d31120f5fc1d65e.pdf; Height: 0.6mm; Manufacturer_Part_Number: RC0805FR-7W10KL; Mouser Part Number: 603-RC0805FR-7W10KL; Mouser Price/Stock: https://www.mouser.co.uk/ProductDetail/YAGEO/RC0805FR-7W10KL?qs=tggtontpCXMsb%2F0we6O%252BLw%3D%3D
R2 R4-R6 = ERJ-H3EF62R0V: Resistor, ERJ-H3EF62R0V, 62ohms; Manufacturer_Name: Panasonic; Datasheet Link: http://industrial.panasonic.com/cdbs/www-data/pdf/RDQ0000/ast-ind-151033.pdf; Manufacturer_Part_Number: ERJ-H3EF62R0V

## Nets that join several sheets
3v3: MCU_Transceiver_Board (18 pins), Microphone (MIC1.1 MIC2.3), Voltage Regulation (6 pins), Motor Circuit (C22.2 MD.3), ESP32 (7 pins)
GND: MCU_Transceiver_Board (28 pins), Microphone (7 pins), Voltage Regulation (7 pins), Battery System (R13.2 U4.1), Motor Circuit (6 pins), ESP32 (20 pins)
BattStat: Voltage Regulation (C16.1 U5.1 U5.3), Battery System (S2.2), ESP32 (ESPIC.3 J4.1)
Data: MCU_Transceiver_Board (JUSART.2 U1.43), ESP32 (ESPIC.15)
I2S2_CK: MCU_Transceiver_Board (U1.34 U1.51), Microphone (JMic.2 MIC1.2 MIC2.6)
I2S2_SD: MCU_Transceiver_Board (U1.36 U1.53), Microphone (JMic.1 MIC1.3 MIC2.7 R20.2)
I2S3_WS: MCU_Transceiver_Board (U1.50), Microphone (MIC2.5)
MControl: MCU_Transceiver_Board (U1.27), Motor Circuit (MD.1)
RXD0: MCU_Transceiver_Board (JUSART.5 U1.37), ESP32 (ESPIC.11)
TXD0: MCU_Transceiver_Board (JUSART.4 U1.38), ESP32 (ESPIC.12)